# Altium project Vreg_Learning_Platform.PrjPcb (part 1 of 5)
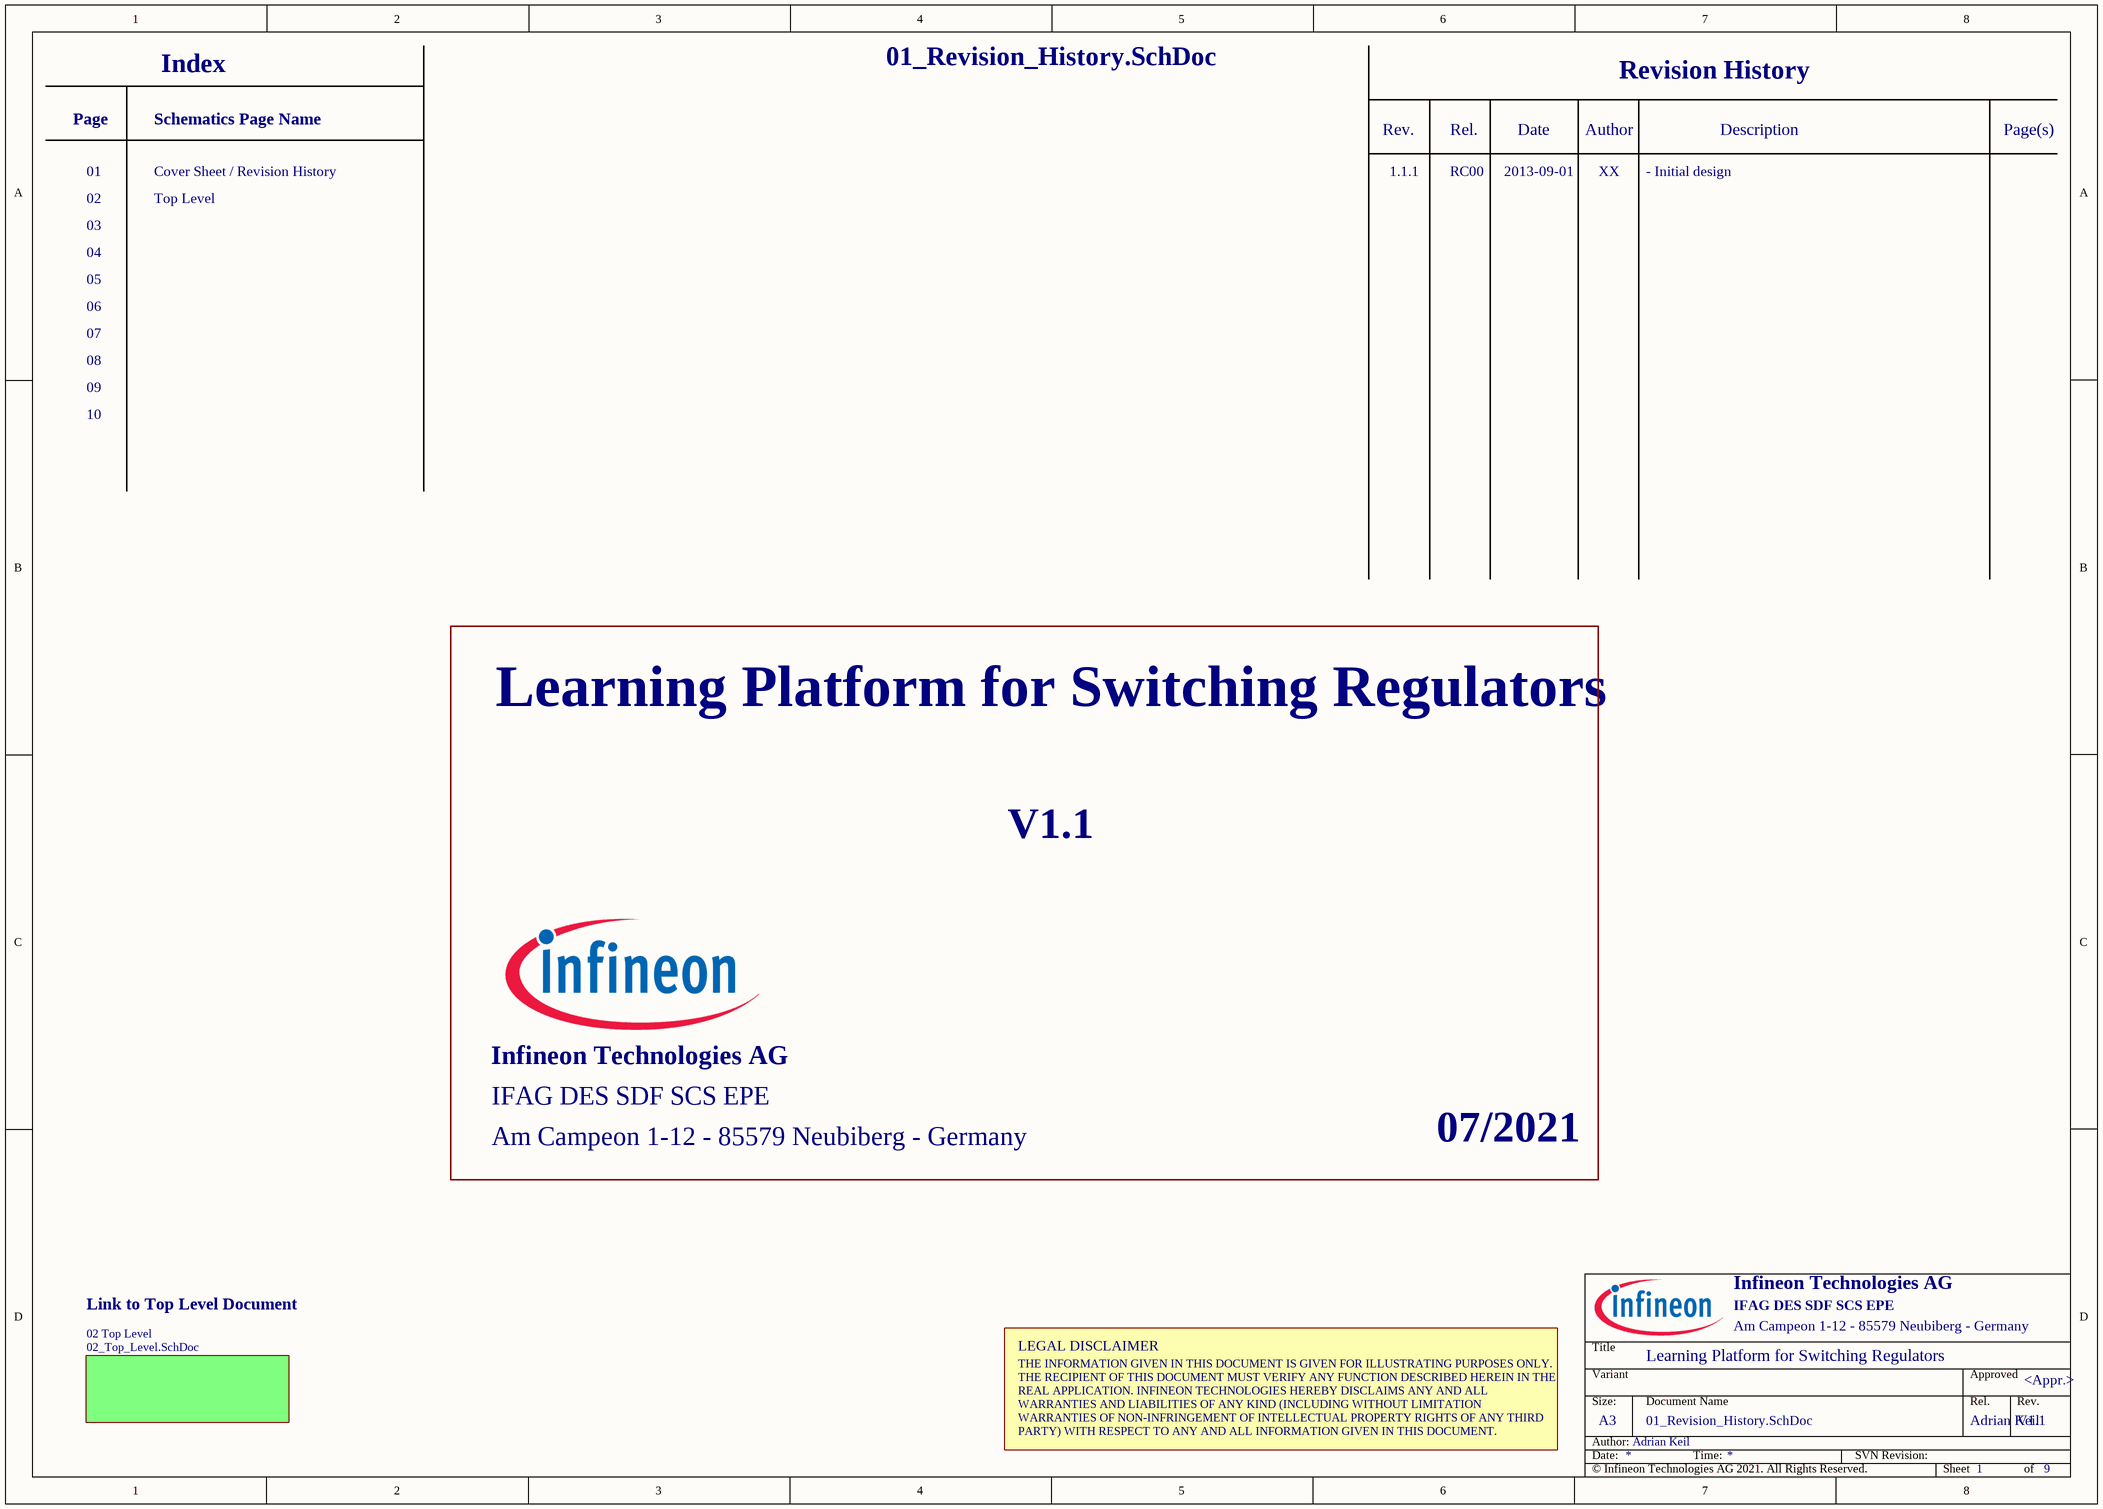
[diagram p0: 01_Revision_History.SchDoc]
PRJ_Year: 07/2021; PRJ_Title: Learning Platform for Switching Regulators; PRJ_SCH_Revision: V1.1; PRJ_SCH_Author: Adrian Keil; PRJ_Revision: V1.1; PRJ_Responsible: Adrian Keil; PRJ_PCB_Revision: V1.1; PRJ_PCB_Release: RC01; PRJ_PCBDesigner: Adrian Keil; PRJ_Organization: Infineon Technologies AG; PRJ_Engineer: Adrian Keil; PRJ_Copyright: © Infineon Technologies AG 2021. All Rights Reserved.; PRJ_Address2: Am Campeon 1-12 - 85579 Neubiberg - Germany; PRJ_Address1: IFAG DES SDF SCS EPE
7 sheets, 308 parts. Net scope: flat (ports and power ports of the same name join across sheets).
Board file: Mainboard.PcbDoc
Sheets:
  01_Revision_History.SchDoc
    02 Top Level = 02_Top_Level.SchDoc
      U_Input = Input.SchDoc
      U_PowerStage = PowerStage.SchDoc
      U_PowerSupply = PowerSupply.SchDoc
      U_Safety = Safety.SchDoc
      U_Output = Output.SchDoc

## Sheet 01_Revision_History.SchDoc: <Project Name>
size A3; ApprovedBy: <Appr.>; Author: <Author>; CompanyName: Infineon Technologies AG; Engineer: <Rel.>; Organization: Infineon Technologies AG; Address1: COM AC SDC SD3; Address2: Am Campeon 1-12  -  85579 Neubiberg  -  Germany; Address3: 85579 Neubiberg; Address4: Germany; DocumentNumber: 1; Revision: <Rev.>; SheetNumber: 1; SheetTotal: 9; Release: RC00; PageSetup: Record=PageOptions|CenterHorizontal=True|CenterVertical=True|PrintScale=1.01|XCorrection=1.00|YCorrection=1.00|PrintKind=0|BorderSize=5000000|LeftOffset=0|BottomOffset=0|Orientation=2|PaperLength=1000|PaperWidth=1000|Scale=100|PaperSource=7|PrintQuality=-4|MediaType=1|DitherType=10|PaperKind=A3|PrintScaleMode=1; Doc_ConfidentialStatus: <Doc_ConfidentialStatus>; Doc_Preliminary: <Doc_Preliminary>

### Sub-sheets
02 Top Level = 02_Top_Level.SchDoc: no entries

### Notes on the sheet
- Index
- Revision History
- Page
- 01
- Cover Sheet / Revision History
- Schematics Page Name
- Rev.
- 1.1.1
- Rel.
- RC00
- 2013-09-01
- Date
- Author
- XX
- - Initial design
- Description
- Page(s)
- 03
- 02
- Top Level
- 04
- 05
- 06
- 07
- 08
- 09
- 10
- Link to Top Level Document
- LEGAL DISCLAIMER
- THE INFORMATION GIVEN IN THIS DOCUMENT IS GIVEN FOR ILLUSTRATING PURPOSES ONLY.
  THE RECIPIENT OF THIS DOCUMENT MUST VERIFY ANY FUNCTION DESCRIBED HEREIN IN THE
  REAL APPLICATION. INFINEON TECHNOLOGIES HEREBY DISCLAIMS ANY AND ALL
  WARRANTIES AND LIABILITIES OF ANY KIND (INCLUDING WITHOUT LIMITATION
  WARRANTIES OF NON-INFRINGEMENT OF INTELLECTUAL PROPERTY RIGHTS OF ANY THIRD
  PARTY) WITH RESPECT TO ANY AND ALL INFORMATION GIVEN IN THIS DOCUMENT.
- Title
- Variant
- Approved
- Date:
- Author:
- Size:
- A3
- Document Name
- Time:
- SVN Revision:
- Sheet
- of

## Sheet 02_Top_Level.SchDoc: <Project Name>
size A3; ApprovedBy: <Appr.>; Author: <Author>; CompanyName: Infineon Technologies AG; Engineer: <Rel.>; Organization: Infineon Technologies AG; Address1: COM AC SDC SD3; Address2: Am Campeon 1-12  -  85579 Neubiberg  -  Germany; Address3: 85579 Neubiberg; Address4: Germany; DocumentNumber: 2; Revision: <Rev.>; SheetNumber: 2; SheetTotal: 9; Release: RC00; PageSetup: Record=PageOptions|CenterHorizontal=True|CenterVertical=True|PrintScale=1.01|XCorrection=1.00|YCorrection=1.00|PrintKind=0|BorderSize=5000000|LeftOffset=0|BottomOffset=0|Orientation=2|PaperLength=1000|PaperWidth=1000|Scale=100|PaperSource=7|PrintQuality=-4|MediaType=1|DitherType=10|PaperKind=A3|PrintScaleMode=1; Doc_ConfidentialStatus: <Doc_ConfidentialStatus>; Doc_Preliminary: <Doc_Preliminary>
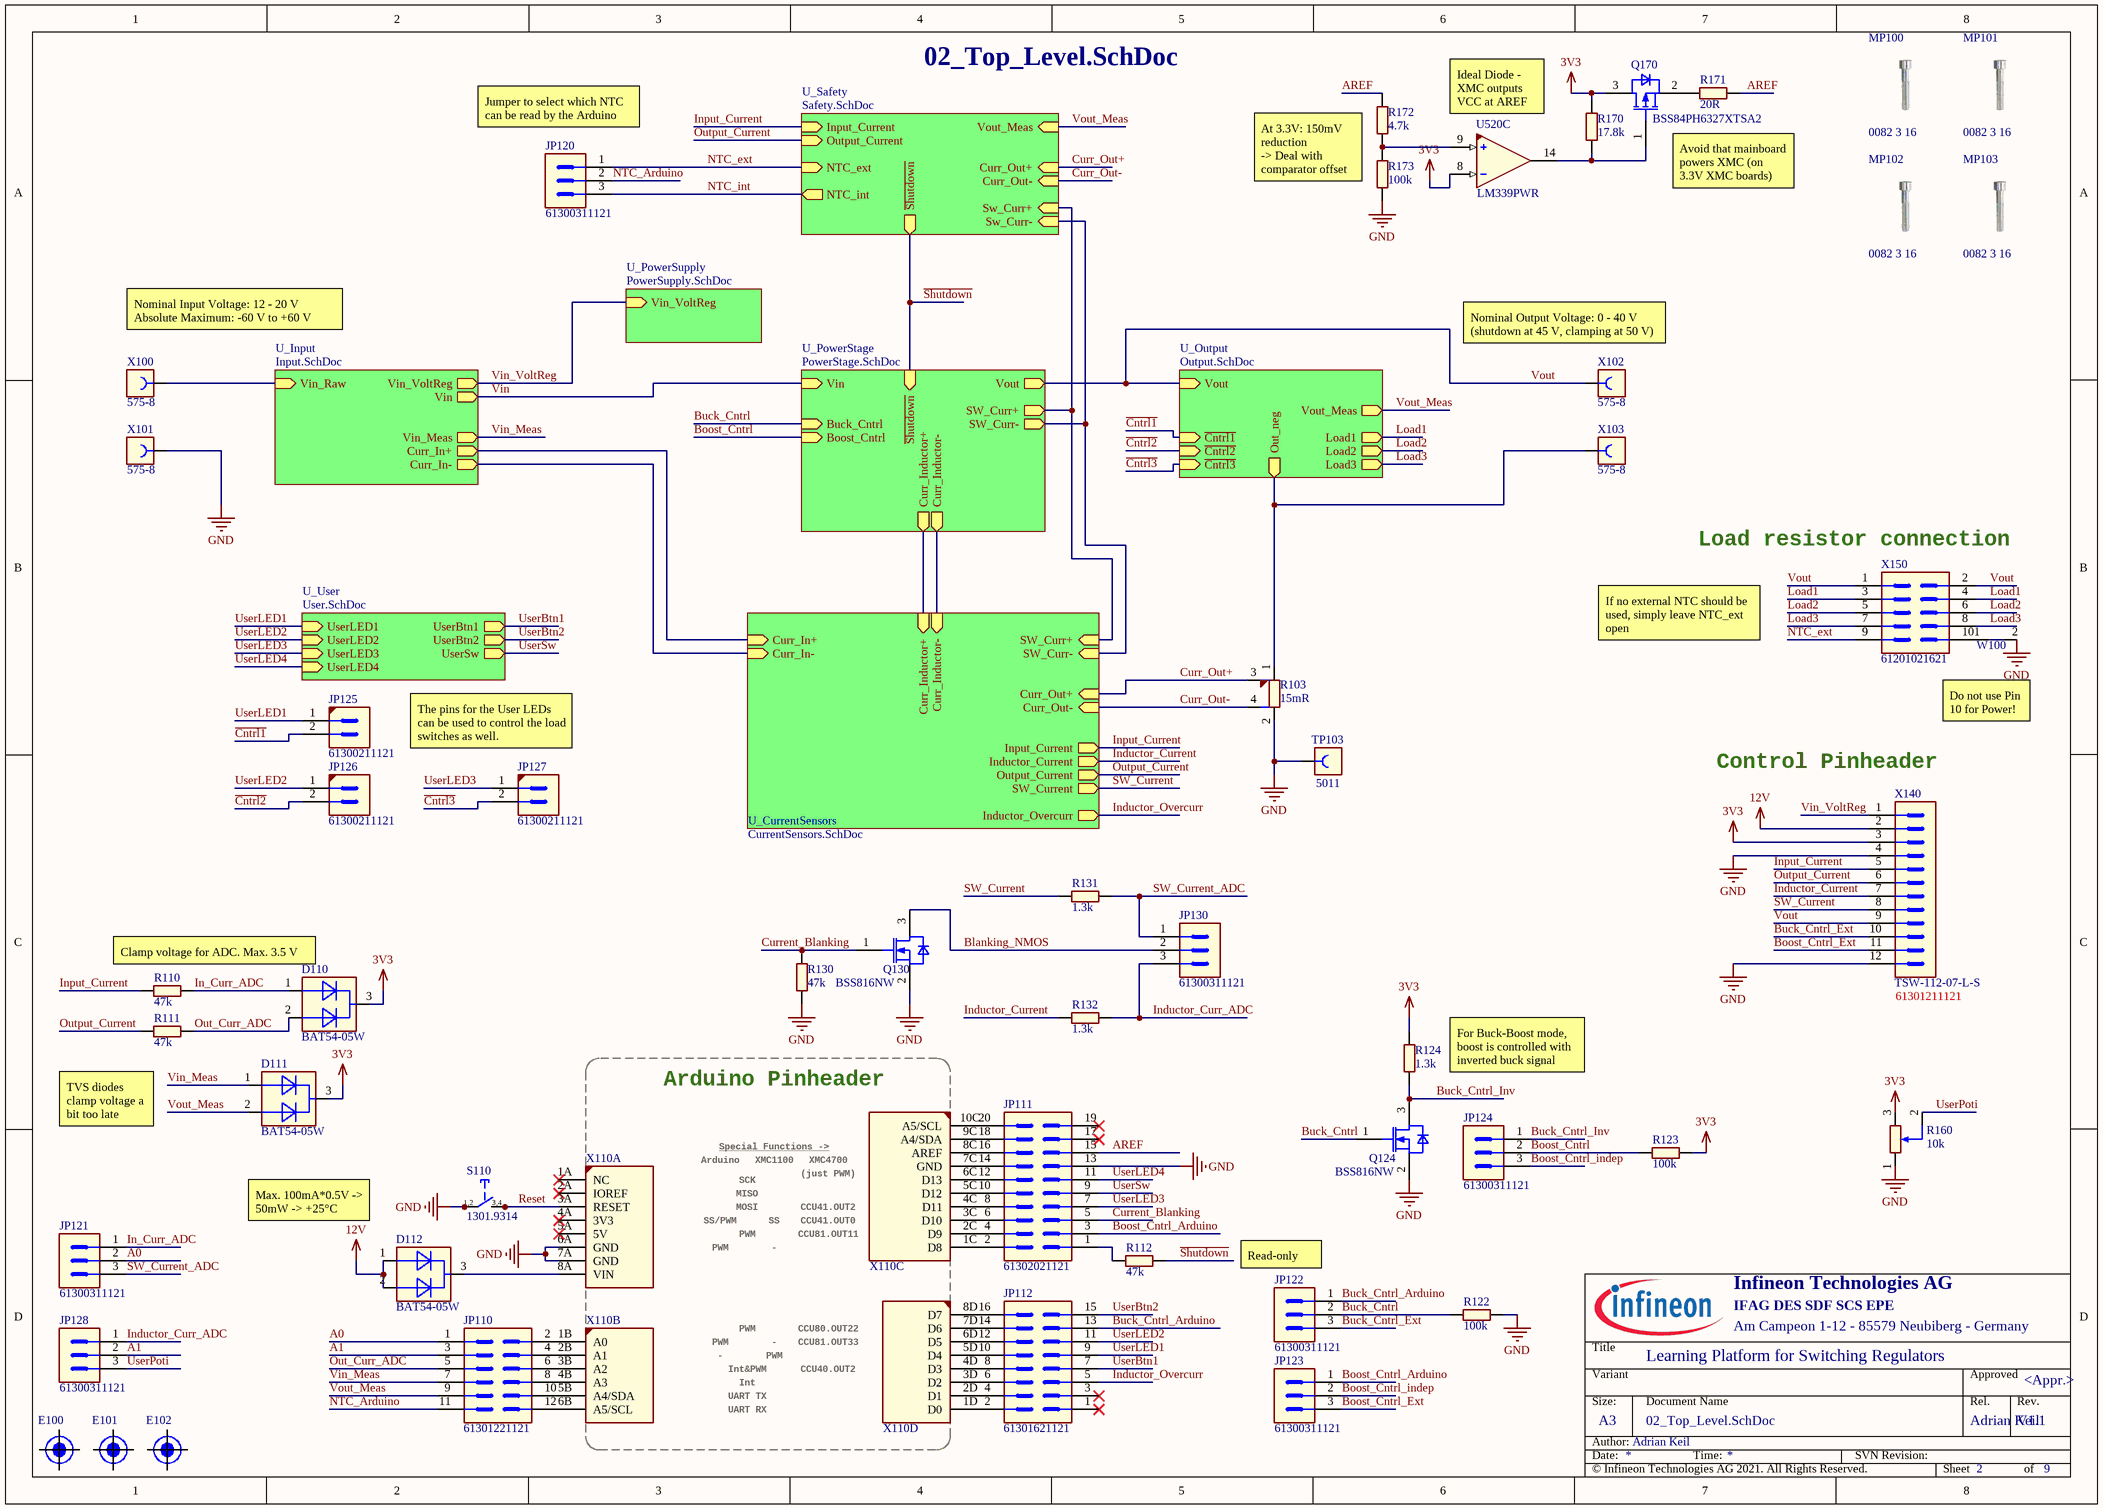
[diagram p1: 02_Top_Level.SchDoc]

### Parts
D110  BAT54-05W  [SOT65P210X100-3N-1-V]
D111  BAT54-05W  [SOT65P210X100-3N-1-V]
D112  BAT54-05W  [SOT65P210X100-3N-1-V]
E100  (no value)  [fiducial]  (no BOM)
E101  (no value)  [fiducial]  (no BOM)
E102  (no value)  [fiducial]  (no BOM)
JP110  61301221121  [CON-M-THT-61301221121]
JP111  61302021121  [CON-M-THT-61302021121]
JP112  61301621121  [CON-M-THT-61301621121]
JP120  61300311121  [CON-M-THT-61300311121]
JP121  61300311121  [CON-M-THT-61300311121]
JP122  61300311121  [CON-M-THT-61300311121]
JP123  61300311121  [CON-M-THT-61300311121]
JP124  61300311121  [CON-M-THT-61300311121]
JP125  61300211121  [CON-M-THT-61300211121]
JP126  61300211121  [CON-M-THT-61300211121]
JP127  61300211121  [CON-M-THT-61300211121]
JP128  61300311121  [CON-M-THT-61300311121]
JP130  61300311121  [CON-M-THT-61300311121]
MP100  0082 3 16  [SCREW_0082 3 16_NPTH]
MP101  0082 3 16  [SCREW_0082 3 16_NPTH]
MP102  0082 3 16  [SCREW_0082 3 16_NPTH]
MP103  0082 3 16  [SCREW_0082 3 16_NPTH]
Q124  BSS816NW  [SOT65P210X100-3N-1-V]
Q130  BSS816NW  [SOT65P210X100-3N-1-V]
Q170  BSS84PH6327XTSA2  [SOT95P240X110-3N-1]
R103  15mR  [RES-SMD-L4T12]
R110  47k  [RESC1609X50N]
R111  47k  [RESC1609X50N]
R112  47k  [RESC1609X50N]
R122  100k  [RESC1609X50N]
R123  100k  [RESC1609X50N]
R124  1.3k  [RESC1609X50N]
R130  47k  [RESC1609X50N]
R131  1.3k  [RESC1609X50N]
R132  1.3k  [RESC1609X50N]
R160  10k  [POT-SMD-3361P]
R170  17.8k  [RESC1609X50N]
R171  20R  [RESC1609X50N]
R172  4.7k  [RESC1609X50N]
R173  100k  [RESC1609X50N]
S110  1301.9314  [SW-SMD-1301.9314]
TP103  5011  [CON-THT-TP-5011]
U520  LM339PWR  [SOP65P640X120-14N-1]  (part C of 5)
W100  Net_Tie_2  [Net_Tie_Small_2P]  (value not drawn)  (net tie, no BOM)
X100  575-8  [CON-F-TH-575-6]
X101  575-8  [CON-F-TH-575-6]
X102  575-8  [CON-F-TH-575-6]
X103  575-8  [CON-F-TH-575-6]
X110  Arduino-Uno  [Arduino-Uno]  (value not drawn)  (parts A,B,C,D of 4)
X140  TSW-112-07-L-S  [HDRV12W64P254_1X12_3048X254X898B]
X150  61201021621  [CON-M-THT-61201021621]

### Sub-sheets
U_CurrentSensors = CurrentSensors.SchDoc (file not in this document): Inductor_Current (out), Output_Current (out), Input_Current (out), Curr_In+ (in), Curr_In- (in), Curr_Inductor+ (in), Curr_Inductor- (in), Curr_Out+ (in), Curr_Out- (in), SW_Curr- (in), SW_Curr+ (in), SW_Current (out), Inductor_Overcurr (out)
U_Input = Input.SchDoc: Vin_Raw (in), Vin (out), Vin_Meas (out), Vin_VoltReg (out), Curr_In+ (out), Curr_In- (out)
U_Output = Output.SchDoc: Vout (in), Load1 (out), Load2 (out), Load3 (out), Vout_Meas (out), ~{Cntrl1} (in), ~{Cntrl2} (in), ~{Cntrl3} (in), Out_neg (out)
U_PowerStage = PowerStage.SchDoc: Vin (in), ~{Shutdown} (in), Buck_Cntrl (in), Boost_Cntrl (in), Vout (out), Curr_Inductor+ (out), Curr_Inductor- (out), SW_Curr+ (out), SW_Curr- (out)
U_PowerSupply = PowerSupply.SchDoc: Vin_VoltReg (in)
U_Safety = Safety.SchDoc: ~{Shutdown} (out), Vout_Meas (in), NTC_ext (in), NTC_int (out), Sw_Curr+ (in), Output_Current (in), Input_Current (in), Sw_Curr- (in), Curr_Out- (in), Curr_Out+ (in)
U_User = User.SchDoc (file not in this document): UserLED1 (in), UserLED2 (in), UserLED3 (in), UserLED4 (in), UserBtn1 (out), UserBtn2 (out), UserSw (out)

### Nets
3V3: D110.3(CATHODE) D111.3(CATHODE) Q170.3(DRAIN) R123.1 R124.2 R160.3 R170.1 U520.8(3IN_N) X140.3
12V: D112.1(ANODE_1) D112.2(ANODE_2) X140.2
GND: JP111.13 Q124.2(SOURCE) Q130.2(SOURCE) R103.2(V2) R122.1 R130.1 R160.1 R173.1 S110.1 S110.2 TP103.1 W100.2 X101.1 X110.6A(GND) X110.7A(GND) X140.4 X140.12
~{Cntrl1}: JP125.2 ; sheet U_Output/~{Cntrl1}
~{Cntrl2}: JP126.2 ; sheet U_Output/~{Cntrl2}
~{Cntrl3}: JP127.2 ; sheet U_Output/~{Cntrl3}
~{Shutdown}: R112.1 ; sheet U_PowerStage/~{Shutdown}, sheet U_Safety/~{Shutdown}
A0: JP110.1 JP121.2
A1: JP110.3 JP128.2
AREF: JP111.15 R171.1 R172.1
Blanking_NMOS: JP130.2 Q130.3(DRAIN)
Boost_Cntrl: JP124.2 R123.2 ; sheet U_PowerStage/Boost_Cntrl
Boost_Cntrl_Arduino: JP111.3 JP123.1
Boost_Cntrl_Ext: JP123.3 X140.11
Boost_Cntrl_indep: JP123.2 JP124.3
Buck_Cntrl: JP122.2 Q124.1(GATE) R122.2 ; sheet U_PowerStage/Buck_Cntrl
Buck_Cntrl_Arduino: JP112.13 JP122.1
Buck_Cntrl_Ext: JP122.3 X140.10
Buck_Cntrl_Inv: JP124.1 Q124.3(DRAIN) R124.1
Curr_Out+: R103.3(I1) ; sheet U_Safety/Curr_Out+, sheet U_CurrentSensors/Curr_Out+
Curr_Out-: R103.4(I2) ; sheet U_Safety/Curr_Out-, sheet U_CurrentSensors/Curr_Out-
Current_Blanking: JP111.5 Q130.1(GATE) R130.2
In_Curr_ADC: D110.1(ANODE_1) JP121.1 R110.1
Inductor_Curr_ADC: JP128.1 JP130.3 R132.1
Inductor_Current: R132.2 X140.7 ; sheet U_CurrentSensors/Inductor_Current
Inductor_Overcurr: JP112.5 ; sheet U_CurrentSensors/Inductor_Overcurr
Input_Current: R110.2 X140.5 ; sheet U_Safety/Input_Current, sheet U_CurrentSensors/Input_Current
Load1: X150.3 X150.4 ; sheet U_Output/Load1
Load2: X150.5 X150.6 ; sheet U_Output/Load2
Load3: X150.7 X150.8 ; sheet U_Output/Load3
NTC_Arduino: JP110.11 JP120.2
NTC_ext: JP120.1 X150.9 ; sheet U_Safety/NTC_ext
NTC_int: JP120.3 ; sheet U_Safety/NTC_int
Out_Curr_ADC: D110.2(ANODE_2) JP110.5 R111.1
Output_Current: R111.2 X140.6 ; sheet U_Safety/Output_Current, sheet U_CurrentSensors/Output_Current
Reset: S110.3 S110.4 X110.3A(RESET)
SW_Current: R131.2 X140.8 ; sheet U_CurrentSensors/SW_Current
SW_Current_ADC: JP121.3 JP130.1 R131.1
UserBtn1: JP112.7 ; sheet U_User/UserBtn1
UserBtn2: JP112.15 ; sheet U_User/UserBtn2
UserLED1: JP112.9 JP125.1 ; sheet U_User/UserLED1
UserLED2: JP112.11 JP126.1 ; sheet U_User/UserLED2
UserLED3: JP111.7 JP127.1 ; sheet U_User/UserLED3
UserLED4: JP111.11 ; sheet U_User/UserLED4
UserPoti: JP128.3 R160.2
UserSw: JP111.9 ; sheet U_User/UserSw
Vin: sheet U_Input/Vin, sheet U_PowerStage/Vin
Vin_Meas: D111.1(ANODE_1) JP110.7 ; sheet U_Input/Vin_Meas
Vin_VoltReg: X140.1 ; sheet U_Input/Vin_VoltReg, sheet U_PowerSupply/Vin_VoltReg
Vout: X102.1 X140.9 X150.1 X150.2 ; sheet U_PowerStage/Vout, sheet U_Output/Vout
Vout_Meas: D111.2(ANODE_2) JP110.9 ; sheet U_Safety/Vout_Meas, sheet U_Output/Vout_Meas
NetD112_3: D112.3(CATHODE) X110.8A(VIN)
NetJP110_2: JP110.2 X110.1B(A0)
NetJP110_4: JP110.4 X110.2B(A1)
NetJP110_6: JP110.6 X110.3B(A2)
NetJP110_8: JP110.8 X110.4B(A3)
NetJP110_10: JP110.10 X110.5B(A4/SDA)
NetJP110_12: JP110.12 X110.6B(A5/SCL)
NetJP111_1: JP111.1 R112.2
NetJP111_2: JP111.2 X110.1C(D8)
NetJP111_4: JP111.4 X110.2C(D9)
NetJP111_6: JP111.6 X110.3C(D10)
NetJP111_8: JP111.8 X110.4C(D11)
NetJP111_10: JP111.10 X110.5C(D12)
NetJP111_12: JP111.12 X110.6C(D13)
NetJP111_14: JP111.14 X110.7C(GND)
NetJP111_16: JP111.16 X110.8C(AREF)
NetJP111_18: JP111.18 X110.9C(A4/SDA)
NetJP111_20: JP111.20 X110.10C(A5/SCL)
NetJP112_2: JP112.2 X110.1D(D0)
NetJP112_4: JP112.4 X110.2D(D1)
NetJP112_6: JP112.6 X110.3D(D2)
NetJP112_8: JP112.8 X110.4D(D3)
NetJP112_10: JP112.10 X110.5D(D4)
NetJP112_12: JP112.12 X110.6D(D5)
NetJP112_14: JP112.14 X110.7D(D6)
NetJP112_16: JP112.16 X110.8D(D7)
NetQ170_1: Q170.1(GATE) R170.2 U520.14(3OUT)
NetQ170_2: Q170.2(SOURCE) R171.2
NetR103_1: R103.1(V1) X103.1 ; sheet U_Output/Out_neg
NetR172_2: R172.2 R173.2 U520.9(3IN_P)
NetW100_1: W100.1 X150.10
NetX100_1: X100.1 ; sheet U_Input/Vin_Raw
(unnamed): sheet U_Input/Curr_In+, sheet U_CurrentSensors/Curr_In+
(unnamed): sheet U_Input/Curr_In-, sheet U_CurrentSensors/Curr_In-
(unnamed): sheet U_PowerStage/Curr_Inductor+, sheet U_CurrentSensors/Curr_Inductor+
(unnamed): sheet U_PowerStage/Curr_Inductor-, sheet U_CurrentSensors/Curr_Inductor-
(unnamed): sheet U_PowerStage/SW_Curr+, sheet U_Safety/Sw_Curr+, sheet U_CurrentSensors/SW_Curr+
(unnamed): sheet U_PowerStage/SW_Curr-, sheet U_Safety/Sw_Curr-, sheet U_CurrentSensors/SW_Curr-

Not connected (* = marked no-connect by the designer): E100 1; E101 1; E102 1; JP111 17* 19*; JP112 1* 3*; X110 1A(NC)* 2A(IOREF)* 4A(3V3)* 5A(5V)*

### Notes on the sheet
- Ideal Diode -
  XMC outputs VCC at AREF
- (near JP120) Jumper to select which NTC  can be read by the Arduino
- At 3.3V: 150mV reduction
  -> Deal with comparator offset
  AREF: 3.45V max.
- (near Q170) Avoid that mainboard powers XMC (on 3.3V XMC boards)
- Nominal Input Voltage: 12 - 20 V
  Absolute Maximum: -60 V to +60 V
- (near X102) Nominal Output Voltage: 0 - 40 V (shutdown at 45 V, clamping at 50 V)
- (near X150) Load resistor connection
- If no external NTC should be used, simply leave NTC_ext open
- Do not use Pin 10 for Power!
- (near JP127) The pins for the User LEDs can be used to control the load switches as well.
- (near X140) Control Pinheader
- Clamp voltage for ADC. Max. 3.5 V
- (near X140) 61301211121
- (near R111) TVS diodes clamp voltage a bit too late
- Arduino Pinheader
- (near R124) For Buck-Boost mode, boost is controlled with inverted buck signal
- Arduino
- SCK
- MISO
- Special Functions ->
- XMC1100
- XMC4700
- (just PWM)
- Max. 100mA*0.5V -> 50mW -> +25°C
- SS/PWM
- PWM
- MOSI
- -
- SS
- CCU41.OUT0
- CCU41.OUT2
- CCU81.OUT11
- (near JP122) Read-only
- CCU80.OUT22
- UART TX
- Int
- Int&PWM
- CCU81.OUT33
- CCU40.OUT2
- UART RX
- Title
- Variant
- Approved
- Date:
- Author:
- Size:
- A3
- Document Name
- Time:
- SVN Revision:
- Rel.
- Rev.
- Sheet
- of
- (in symbol 380147) 1,2; 3,4

### Library data of the parts
D110-D112 = 592214: Silicon Schottky Diode, VR 30V; Manufacturer: Infineon Technologies; Symbol type: Dual Diode Symbol 3 Pins, 1 Anode, 2 Anode, 3 Cathode; Article Number: 592214; Version Number: V01; Combined Parameters: Vf:800mV;If:200mA;Ur:30V;Ir:2uA;Pmax:230mW; QuickPick: Schottky Diode / PG-SOT323-3-1; Style: Single; Automotive Qualified: AEC Q101; ComponentStatus: Released; PLMStatus: Active; Second Source allowed: Yes; Voltage DC (max): na; Part Type: Diode; Manufacturer Order Number: BAT54-05W; Value: BAT54-05W; Type: Schottky Diode; Application: Protection; Temperature min: 0; Temperature max: 150; Temperature Range: Military; ROHS Compliant: Y; PackageReference: PG-SOT323-3-1; ComponentLink1Description: Vendor WebSite; ComponentLink1URL: https://www.infineon.com/; ComponentLink2Description: Datasheet; ComponentLink2URL: http://webnetprod.muc.infineon.com/PCBPortal_Prod/WorkFlows/AltiumComponent/StandardDocumentation?Versionid=592215; Supplier 1: Farnell; Supplier Part Number 1: 2787840; Supplier 2: DigiKey; Supplier Part Number 2: BAT5405WH6327XTSA1TR-ND; Supplier 3: Mouser; Package Description: SOT,0.65mm pitch;3 pin,1.25mm W X 2.00mm L X 1.00mm H body
E100-E102 = 416637: Fiducial Mark; Legacy PartNumber: MEC10000008; Manufacturer: Infineon Technologies; Alternate View: No; Symbol Type: Fiducial Marker For PCB; Article Number: 416637; Version Number: V01; Legacy DeviceID: MEC_Fiducial_Mark; Combined Parameters: - - -x- -; ComponentStatus: Released; PLMStatus: Active; Second Source allowed: Yes; Voltage DC (max): na; Multible Parts: No; Part Type: Mechanical; Temperature min: 0; Temperature max: 0; Temperature Range: Military; ComponentLink1Description: Vendor WebSite; ComponentLink1URL: https://www.infineon.com/; ComponentLink2Description: Datasheet; ComponentLink2URL: http://webnetprod.muc.infineon.com/PCBPortal_Prod/WorkFlows/AltiumComponent/StandardDocumentation?Versionid=416638; Supplier 1: Farnell; Supplier 2: DigiKey; Supplier 3: Mouser
JP110 = 651705: WR-PHD Dual Pin Header, 2.54mm Pitch, Double row, 12 Pins; Manufacturer: Wurth Elektronik; Article Number: 651705; Version Number: V00; Legacy DeviceID: WE_61301221121; Combined Parameters: Board-to-Board Header (male);2x6;Mounting:THT;Orient:0° (vertical);Shielded:No; QuickPick: 0° (vertical) / Board-to-Board; Style: Strip; Automotive Qualified: No; ComponentStatus: Released; PLMStatus: Active; Second Source allowed: Yes; Voltage DC (max): na; Part Type: Connector; Manufacturer Order Number: 61301221121; Value: 61301221121; Type: Board-to-Board; Temperature min: -40; Temperature max: 105; Temperature Range: Industrial; ROHS Compliant: Y; PackageReference: 2.54mm THT; ComponentLink1Description: Vendor WebSite; ComponentLink1URL: http://www.we-online.com; ComponentLink2Description: Datasheet; ComponentLink2URL: http://webnetprod.muc.infineon.com/PCBPortal_Prod/WorkFlows/AltiumComponent/StandardDocumentation?Versionid=651706; Supplier 1: Farnell; Supplier Part Number 1: 2356134; Supplier 2: DigiKey; Supplier Part Number 2: 732-5297-ND; Supplier 3: Mouser; Supplier Part Number 3: 710-61301221121; Package Description: Connector, THT, 2.54 mm pitch, 12 pin, 5.08 mm L X 15.24 mm W X 8.89 mm H body
JP111 = 651707: WR-PHD Dual Pin Header, 2.54mm Pitch, Double row, 20 Pins; Manufacturer: Wurth Elektronik; Article Number: 651707; Version Number: V00; Legacy DeviceID: WE_61302021121; Combined Parameters: Board-to-Board Header (male);2x10;Mounting:THT;Orient:0° (vertical);Shielded:No; QuickPick: 0° (vertical) / Board-to-Board; Style: Strip; Automotive Qualified: No; ComponentStatus: Released; PLMStatus: Active; Second Source allowed: Yes; Voltage DC (max): na; Symbol Type: Header 10x2; Part Type: Connector; Manufacturer Order Number: 61302021121; Value: 61302021121; Type: Board-to-Board; Temperature min: -40; Temperature max: 105; Temperature Range: Industrial; ROHS Compliant: Y; PackageReference: 2.54mm THT; ComponentLink1Description: Vendor WebSite; ComponentLink1URL: http://www.we-online.com; ComponentLink2Description: Datasheet; ComponentLink2URL: http://webnetprod.muc.infineon.com/PCBPortal_Prod/WorkFlows/AltiumComponent/StandardDocumentation?Versionid=651708; Supplier 1: Farnell; Supplier Part Number 1: 2356138; Supplier 2: DigiKey; Supplier Part Number 2: 732-5301-ND; Supplier 3: Mouser; Supplier Part Number 3: 710-61302021121; Package Description: Connector, THT, 2.54 mm Pitch, 20 pin, 5.08 mm L X 25.40 mm W X 8.89 mm H body
JP112 = 638527: Connector Header Through Hole 16 position 0.100 (2.54mm); Manufacturer: Wurth Elektronik; Article Number: 638527; Version Number: V01; Legacy DeviceID: WE_61301621121; Combined Parameters: Board-to-Board Header (male);8x2;Mounting:THT;Orient:0° (vertical);Shielded:No; QuickPick: 0° (vertical) / Board-to-Board; Style: Strip; Automotive Qualified: No; ComponentStatus: Released; PLMStatus: Active; Second Source allowed: Yes; Voltage DC (max): na; Part Type: Connector; Manufacturer Order Number: 61301621121; Value: 61301621121; Type: Board-to-Board; Temperature min: -40; Temperature max: 105; Temperature Range: Industrial; ROHS Compliant: Y; PackageReference: THT; ComponentLink1Description: Vendor WebSite; ComponentLink1URL: http://www.we-online.com; ComponentLink2Description: Datasheet; ComponentLink2URL: http://webnetprod.muc.infineon.com/PCBPortal_Prod/WorkFlows/AltiumComponent/StandardDocumentation?Versionid=638528; Supplier 1: Farnell; Supplier Part Number 1: 2356136; Supplier 2: DigiKey; Supplier Part Number 2: 732-5299-ND; Supplier 3: Mouser; Supplier Part Number 3: 710-61301621121; Package Description: Connector, THT, 2.54 mm pitch, 16 pin, 5.08 mm L X 20.32 mm W X 8.89 mm H body
JP120-JP124 JP128 JP130 = 633993: WR-PHD Pin Header; Manufacturer: Wurth Elektronik; Article Number: 633993; Version Number: V01; Legacy DeviceID: WE_61300311121; Combined Parameters: Board-to-Cable Header (male);3x1;Mounting:THT;Orient:0° (vertical);Shielded:No; QuickPick: 0° (vertical) / Board-to-Cable; Style: Strip; Automotive Qualified: No; ComponentStatus: Released; PLMStatus: Active; Second Source allowed: Yes; Voltage DC (max): na; Part Type: Connector; Manufacturer Order Number: 61300311121; Value: 61300311121; Type: Board-to-Cable; Temperature min: -40; Temperature max: 105; Temperature Range: Industrial; ROHS Compliant: Y; PackageReference: THT; ComponentLink1Description: Vendor WebSite; ComponentLink1URL: http://www.we-online.com; ComponentLink2Description: Datasheet; ComponentLink2URL: http://webnetprod.muc.infineon.com/PCBPortal_Prod/WorkFlows/AltiumComponent/StandardDocumentation?Versionid=633994; Supplier 1: Farnell; Supplier Part Number 1: 2356154; Supplier 2: DigiKey; Supplier Part Number 2: 732-5316-ND; Supplier 3: Mouser; Supplier Part Number 3: 710-61300311121; Package Description: Connector, THT; 2.54mm pitch, 7.62 mm L X 2.54 mm X 8.89 mm H body
JP125-JP127 = 386760: Header, 2.54mm Pitch, 2 pin, Vertical, Single Row; Legacy PartNumber: CON01500943; Manufacturer: Wurth Elektronik; Alternat View: Yes; Article Number: 386760; Version Number: V01; Legacy DeviceID: WE_61300211121; Combined Parameters: Board-to-Board Header (male);2x1;Mounting:THT;Orient:0° (vertical);Shielded:No; QuickPick: 0° (vertical) / Board-to-Board; Style: Strip; Automotive Qualified: No; ComponentStatus: Released; PLMStatus: Active; Voltage DC (max): na; Part Type: Connector; Manufacturer Order Number: 61300211121; Value: 61300211121; Type: Board-to-Board; Temperature min: -40; Temperature max: 105; Temperature Range: Industrial; ROHS Compliant: Y; ComponentLink1Description: Vendor WebSite; ComponentLink1URL: http://www.we-online.com; ComponentLink2Description: Datasheet; ComponentLink2URL: http://webnetprod.muc.infineon.com/PCBPortal_Prod/WorkFlows/AltiumComponent/StandardDocumentation?Versionid=386761; Supplier 1: Farnell; Supplier Part Number 1: 2356153; Supplier 2: DigiKey; Supplier Part Number 2: 732-5315-ND; Supplier 3: Mouser; Supplier Part Number 3: 710-61300211121; Second Source allowed: Yes; Package Description: Header, Vertical, 2.54mm Pitch; 2 Pins, Single row, 5.08mm L X 2.54mm W X 8.89mm H body
MP100-MP103 = 455343: Cheese Head Screw With Hexagon Socket, DIN 912 (ISO 4762), M3, 16mm length; Legacy PartNumber: MEC10000167; Manufacturer: Wurth Elektronik; Alternate View: No; Symbol Type: Cheese-Head Screw, M2.5X5-DIN 912; Article Number: 455343; Version Number: V01; Legacy DeviceID: MEC_0082 3 16; Combined Parameters: Steel Hexagonal 19x5.68 Screw; Style: Hexagonal; ComponentStatus: Released; PLMStatus: Active; Second Source allowed: Yes; Voltage DC (max): na; Multiple Parts: No; Part Type: Mechanical; Manufacturer Order Number: 0082 3 16; Value: 0082 3 16; QuickPick: Screw; Type: Screw; Temperature min: 0; Temperature max: 0; Temperature Range: Military; ROHS Compliant: N; Automotive Qualified: No; PackageReference: THT; ComponentLink1Description: Vendor WebSite; ComponentLink1URL: http://www.we-online.com; ComponentLink2Description: Datasheet; ComponentLink2URL: http://webnetprod.muc.infineon.com/PCBPortal_Prod/WorkFlows/AltiumComponent/StandardDocumentation?Versionid=455344; Supplier 1: Farnell; Supplier 2: DigiKey; Supplier 3: Mouser; Package Description: M3 Cheese Head Screw X 5.68mm Head
Q124 Q130 = 644598: OptiMOS 2 Small-Signal-Transistor; Manufacturer: Infineon Technologies; Symbol Type: Insulated-Gate Field-Effect Transistor (IGFET), N-Channel, Depletion,  Body Diode, Pin 1 Gate, 2 Source, 3 Drain, 3 Pins; Article Number: 644598; Version Number: V01; Legacy DeviceID: IFX_BSS816NW; Combined Parameters: N-Channel Enhancement;Uds:20V;Id:1.4A;Rds:240R;P:500mW; QuickPick: N-Channel Enhancement / 500mW / 1.4A / 20V / PG-SOT323-3-2; Type: N-Channel Enhancement; Style: Single; Automotive Qualified: AEC Q101; ComponentStatus: Released; PLMStatus: Active; Second Source allowed: Yes; Voltage DC (max): na; Part Type: Transistor FET; Manufacturer Order Number: BSS816NW; Value: BSS816NW; Application: Small Signal; Temperature min: -55; Temperature max: 150; Temperature Range: Military; ROHS Compliant: Y; PackageReference: PG-SOT323-3-2; ComponentLink1Description: Vendor WebSite; ComponentLink1URL: https://www.infineon.com/; ComponentLink2Description: Datasheet; ComponentLink2URL: http://webnetprod.muc.infineon.com/PCBPortal_Prod/WorkFlows/AltiumComponent/StandardDocumentation?Versionid=644599; Supplier 1: Farnell; Supplier Part Number 1: 2617470; Supplier 2: DigiKey; Supplier Part Number 2: BSS816NWH6327XTSA1CT-ND; Supplier 3: Mouser; Supplier Part Number 3: 726-SP000917562; Package Description: SOT,0.65mm pitch;3 pin,1.25mm W X 2.00mm L X 1.00mm H body
Q170 = 422992: SIPMOS P-Channel Enhancement Small-Signal-Transistor; Legacy PartNumber: IFX01400461; Manufacturer: Infineon Technologies; Symbol Type: Insulated-Gate Field-Effect Transistor (IGFET), P-Channel, Enhancement,  Body Diode, Pin 1 Gate, 2 Source, 3 Drain, 3 Pins; Article Number: 422992; Version Number: V01; Legacy DeviceID: IFX_BSS84PH6327XTSA2; Combined Parameters: P-Channel;Uds:-60V;Id:-170mA;Rds:12R;P:360mW; QuickPick: P-Channel / 360mW / -170mA / -60V / PG-SOT23; Style: Single; Automotive Qualified: AEC Q101; ComponentStatus: Released; PLMStatus: Active; Second Source allowed: Yes; Voltage DC (max): na; Part Type: Transistor FET; Manufacturer Order Number: BSS84PH6327XTSA2; Value: BSS84PH6327XTSA2; Type: P-Channel; Application: Power Supply; Temperature min: -55; Temperature max: 150; Temperature Range: Military; ROHS Compliant: Y; PackageReference: PG-SOT23; ComponentLink1Description: Vendor WebSite; ComponentLink1URL: https://www.infineon.com/; ComponentLink2Description: Datasheet; ComponentLink2URL: http://webnetprod.muc.infineon.com/PCBPortal_Prod/WorkFlows/AltiumComponent/StandardDocumentation?Versionid=422993; Supplier 1: Farnell; Supplier Part Number 1: 1056526; Supplier 2: DigiKey; Supplier Part Number 2: BSS84PH6327XTSA2TR-ND; Supplier 3: Mouser; Supplier Part Number 3: 726-BSS84PH6327XTSA2; Package Description: SOT23, 3-Leads, Body 2.90x2.40mm, Pitch 0.95mm, IPC Medium Density
R103 = 644055: RES / STD / 15mR / 500mW / 1% / 75ppm/K / -55°C to 155°C / 1206 (3216) / SMD / -; Multiple Parts: No; Manufacturer: Ohmite; Manufacturer Order Number: L4T12FR015FER; Symbol Type: Resistor; 4-Terminal (Shunt); Standard; 4 Pins; Alternate View: Yes; Article Number: 644055; Version Number: V01; Combined Parameters: TCR:75ppm/K;Tol.:-1%/+1%;Vdc:-;Idc:-;P:500mW; QuickPick: 15mR / 1% / 0.5 / 1206 (3216); Style: 4-Terminal (Shunt); ComponentStatus: Released; PLMStatus: Active; Part Type: Resistor; Value: 15mR; Tolerance Neg: 1%; Tolerance Pos: 1%; Type: Standard; Application: Precision; Technology: Thick Film; Temperature min: -55; Temperature max: 155; Temperature Range: Military; ROHS Compliant: Y; Automotive Qualified: No; PackageReference: 1206 (3216); ComponentLink1Description: Vendor WebSite; ComponentLink1URL: http://www.ohmite.com; ComponentLink2Description: Datasheet; ComponentLink2URL: http://webnetprod.muc.infineon.com/PCBPortal_Prod/WorkFlows/AltiumComponent/StandardDocumentation?Versionid=644056; Supplier 1: Farnell; Supplier Part Number 1: 3274221; Supplier 2: DigiKey; Supplier Part Number 2: 273-L4T12FR015FERCT-ND; Supplier 3: Mouser; Supplier Part Number 3: 284-L4T12FR015FER; Second Source allowed: Yes; Package Description: Resistor, SMD, 4 pin, 3.00 mm L X 1.60 mm W X 0.65 mm H body
R110-R112 R130 = 346552: RES / STD / 47k / 100mW / 1% / 100ppm/K / -55°C to 155°C / 0603 / SMD / -; Multiple Parts: No; Legacy PartNumber: RES01801333; Manufacturer: Vishay; Manufacturer Order Number: CRCW060347K0FK; Symbol Type: Resistor; Single; Standard; 2 Pins; Alternate View: Yes; Article Number: 346552; Version Number: V01; Combined Parameters: TCR:100ppm/K;Tol.:-1%/+1%;Vdc:75V;Idc:-;P:100mW; QuickPick: 47k / 1% / 0.1 / 0603; Style: Single; Automotive Qualified: AEC Q200; ComponentStatus: Released; PLMStatus: Active; Voltage DC (max): 75V; Legacy DeviceID: RES01801333; Part Type: Resistor; Value: 47k; Tolerance Neg: 1%; Tolerance Pos: 1%; Type: Standard; Technology: Thick Film; Temperature min: -55; Temperature max: 155; Temperature Range: Military; ROHS Compliant: Y; PackageReference: 0603; ComponentLink1Description: Vendor WebSite; ComponentLink1URL: http://www.vishay.com; ComponentLink2Description: Datasheet; ComponentLink2URL: http://webnetprod.muc.infineon.com/PCBPortal_Prod/WorkFlows/AltiumComponent/StandardDocumentation?Versionid=346553; Supplier 1: Farnell; Supplier 2: DigiKey; Supplier Part Number 2: 541-47.0KHCT-ND; Supplier 3: Mouser; Second Source allowed: Yes
R122 R123 R173 = 346742: RES / STD / 100k / 100mW / 1% / 100ppm/K / -55°C to 155°C / 0603 / SMD / -; Multiple Parts: No; Legacy PartNumber: RES01801371; Manufacturer: Vishay; Manufacturer Order Number: CRCW0603100KFK; Symbol Type: Resistor; Single; Standard; 2 Pins; Alternate View: Yes; Article Number: 346742; Version Number: V01; Combined Parameters: TCR:100ppm/K;Tol.:-1%/+1%;Vdc:75V;Idc:-;P:100mW; QuickPick: 100k / 1% / 0.1 / 0603; Style: Single; Automotive Qualified: AEC Q200; ComponentStatus: Released; PLMStatus: Active; Voltage DC (max): 75V; Legacy DeviceID: RES01801371; Part Type: Resistor; Value: 100k; Tolerance Neg: 1%; Tolerance Pos: 1%; Type: Standard; Technology: Thick Film; Temperature min: -55; Temperature max: 155; Temperature Range: Military; ROHS Compliant: Y; PackageReference: 0603; ComponentLink1Description: Vendor WebSite; ComponentLink1URL: http://www.vishay.com; ComponentLink2Description: Datasheet; ComponentLink2URL: http://webnetprod.muc.infineon.com/PCBPortal_Prod/WorkFlows/AltiumComponent/StandardDocumentation?Versionid=346743; Supplier 1: Farnell; Supplier Part Number 1: 1469649; Supplier 2: DigiKey; Supplier 3: Mouser; Second Source allowed: Yes
R124 R131 R132 = 345662: RES / STD / 1.3k / 100mW / 1% / 100ppm/K / -55°C to 155°C / 0603 / SMD / -; Multiple Parts: No; Legacy PartNumber: RES01801155; Manufacturer: Vishay; Manufacturer Order Number: CRCW06031K30FK; Symbol Type: Resistor; Single; Standard; 2 Pins; Alternate View: Yes; Article Number: 345662; Version Number: V01; Combined Parameters: TCR:100ppm/K;Tol.:-1%/+1%;Vdc:75V;Idc:-;P:100mW; QuickPick: 1.3k / 1% / 0.1 / 0603; Style: Single; Automotive Qualified: AEC Q200; ComponentStatus: Released; PLMStatus: Active; Voltage DC (max): 75V; Legacy DeviceID: RES01801155; Part Type: Resistor; Value: 1.3k; Tolerance Neg: 1%; Tolerance Pos: 1%; Type: Standard; Technology: Thick Film; Temperature min: -55; Temperature max: 155; Temperature Range: Military; ROHS Compliant: Y; PackageReference: 0603; ComponentLink1Description: Vendor WebSite; ComponentLink1URL: http://www.vishay.com; ComponentLink2Description: Datasheet; ComponentLink2URL: http://webnetprod.muc.infineon.com/PCBPortal_Prod/WorkFlows/AltiumComponent/StandardDocumentation?Versionid=345663; Supplier 1: Farnell; Supplier 2: DigiKey; Supplier 3: Mouser; Second Source allowed: Yes
R160 = 630020: RES / VAR / 10k / 500mW / 10% / 100ppm/K / -55°C to 125°C /  3 pin, 7.04 mm L X 6.71 mm W X 5.84 mm H Body / SMD / -; Multiple Parts: No; Manufacturer: Bourns; Manufacturer Order Number: 3361P-1-103GLF; Alternate View: Yes; Symbol Type: Resistor; Single; Variable; 3 Pins; Article Number: 630020; Version Number: V01; Combined Parameters: TCR:100ppm/K;Tol.:-10%/+10%;Vdc:-;Idc:-;P:500mW; QuickPick: 10k / 10% / 0.5 / SMD; Style: Single; ComponentStatus: Released; PLMStatus: Active; Part Type: Resistor; Value: 10k; Tolerance Neg: 10%; Tolerance Pos: 10%; Type: Variable; Application: Standard; Temperature min: -55; Temperature max: 125; Temperature Range: Military; ROHS Compliant: Y; Automotive Qualified: No; PackageReference: SMD; ComponentLink1Description: Vendor WebSite; ComponentLink1URL: http://www.bourns.com; ComponentLink2Description: Datasheet; ComponentLink2URL: http://webnetprod.muc.infineon.com/PCBPortal_Prod/WorkFlows/AltiumComponent/StandardDocumentation?Versionid=630021; Supplier 1: Farnell; Supplier Part Number 1: 1696060; Supplier 2: DigiKey; Supplier Part Number 2: 3361P-103GLFCT-ND; Supplier 3: Mouser; Supplier Part Number 3: 652-3361P-1-103GLF; Second Source allowed: Yes; Package Description: Potentiometer, SMD; 3 pin, 7.04 mm L X 6.71 mm W X 5.84 mm H Body
R170 = 346302: RES / STD / 17.8k / 100mW / 1% / 100ppm/K / -55°C to 155°C / 0603 / SMD / -; Multiple Parts: No; Legacy PartNumber: RES01801283; Manufacturer: Vishay; Manufacturer Order Number: CRCW060317K8FK; Symbol Type: Resistor; Single; Standard; 2 Pins; Alternate View: Yes; Article Number: 346302; Version Number: V01; Combined Parameters: TCR:100ppm/K;Tol.:-1%/+1%;Vdc:75V;Idc:-;P:100mW; QuickPick: 17.8k / 1% / 0.1 / 0603; Style: Single; Automotive Qualified: AEC Q200; ComponentStatus: Released; PLMStatus: Active; Voltage DC (max): 75V; Legacy DeviceID: RES01801283; Part Type: Resistor; Value: 17.8k; Tolerance Neg: 1%; Tolerance Pos: 1%; Type: Standard; Technology: Thick Film; Temperature min: -55; Temperature max: 155; Temperature Range: Military; ROHS Compliant: Y; PackageReference: 0603; ComponentLink1Description: Vendor WebSite; ComponentLink1URL: http://www.vishay.com; ComponentLink2Description: Datasheet; ComponentLink2URL: http://webnetprod.muc.infineon.com/PCBPortal_Prod/WorkFlows/AltiumComponent/StandardDocumentation?Versionid=346303; Supplier 1: Farnell; Supplier 2: DigiKey; Supplier 3: Mouser; Second Source allowed: Yes
R171 = 344622: RES / STD / 20R / 100mW / 1% / 100ppm/K / -55°C to 155°C / 0603 / SMD / -; Multiple Parts: No; Legacy PartNumber: RES01800947; Manufacturer: Vishay; Manufacturer Order Number: CRCW060320R0FK; Symbol Type: Resistor; Single; Standard; 2 Pins; Alternate View: Yes; Article Number: 344622; Version Number: V01; Combined Parameters: TCR:100ppm/K;Tol.:-1%/+1%;Vdc:75V;Idc:-;P:100mW; QuickPick: 20R / 1% / 0.1 / 0603; Style: Single; Automotive Qualified: AEC Q200; ComponentStatus: Released; PLMStatus: Active; Voltage DC (max): 75V; Legacy DeviceID: RES01800947; Part Type: Resistor; Value: 20R; Tolerance Neg: 1%; Tolerance Pos: 1%; Type: Standard; Technology: Thick Film; Temperature min: -55; Temperature max: 155; Temperature Range: Military; ROHS Compliant: Y; PackageReference: 0603; ComponentLink1Description: Vendor WebSite; ComponentLink1URL: http://www.vishay.com; ComponentLink2Description: Datasheet; ComponentLink2URL: http://webnetprod.muc.infineon.com/PCBPortal_Prod/WorkFlows/AltiumComponent/StandardDocumentation?Versionid=344623; Supplier 1: Farnell; Supplier 2: DigiKey; Supplier 3: Mouser; Second Source allowed: Yes
R172 = 345982: RES / STD / 4.7k / 100mW / 1% / 100ppm/K / -55°C to 155°C / 0603 / SMD / -; Multiple Parts: No; Legacy PartNumber: RES01801219; Manufacturer: Vishay; Manufacturer Order Number: CRCW06034K70FK; Symbol Type: Resistor; Single; Standard; 2 Pins; Alternate View: Yes; Article Number: 345982; Version Number: V01; Combined Parameters: TCR:100ppm/K;Tol.:-1%/+1%;Vdc:75V;Idc:-;P:100mW; QuickPick: 4.7k / 1% / 0.1 / 0603; Style: Single; Automotive Qualified: AEC Q200; ComponentStatus: Released; PLMStatus: Active; Voltage DC (max): 75V; Legacy DeviceID: RES01801219; Part Type: Resistor; Value: 4.7k; Tolerance Neg: 1%; Tolerance Pos: 1%; Type: Standard; Technology: Thick Film; Temperature min: -55; Temperature max: 155; Temperature Range: Military; ROHS Compliant: Y; PackageReference: 0603; ComponentLink1Description: Vendor WebSite; ComponentLink1URL: http://www.vishay.com; ComponentLink2Description: Datasheet; ComponentLink2URL: http://webnetprod.muc.infineon.com/PCBPortal_Prod/WorkFlows/AltiumComponent/StandardDocumentation?Versionid=345983; Supplier 1: Farnell; Supplier 2: DigiKey; Supplier 3: Mouser; Second Source allowed: Yes
S110 = 380147: Pushbutton Tactile Switch, Single Pole Single Throw, 4 Pins; Legacy PartNumber: CON01500305; Manufacturer: Schurter; Symbol type: Tactile Switch, Spring Return, Single Pole Single Throw - Normally Open, 4 Pins; Article Number: 380147; Version Number: V01; Legacy DeviceID: SCH_1301.9314; ComponentStatus: Released; PLMStatus: Active; Second Source allowed: Yes; Voltage DC (max): na; Part Type: Electro Mechanic; Manufacturer Order Number: 1301.9314; Value: 1301.9314; Temperature min: -20; Temperature max: 70; Temperature Range: Commercial; ROHS Compliant: Y; ComponentLink1Description: Vendor WebSite; ComponentLink1URL: http://www.schurter.com.sg/; ComponentLink2Description: Datasheet; ComponentLink2URL: http://webnetprod.muc.infineon.com/PCBPortal_Prod/WorkFlows/AltiumComponent/StandardDocumentation?Versionid=380148; Supplier 1: Farnell; Supplier Part Number 1: 1217763; Supplier 2: DigiKey; Supplier Part Number 2: 1301.9314-ND; Supplier 3: Mouser; Supplier Part Number 3: 693-1301.9314; Package Description: SMD Switch, 6.00mm L X 6.00mm W X 4.3mm H body
TP103 = 382410: PC Test Point-Multipurpose THT, Black; Multiple Parts: No; Legacy PartNumber: CON01500530; Manufacturer: Keystone Electronics Corp.; Symbol Type: Connector, 1 Lead, Female; Alternate View: Yes; Article Number: 382410; Version Number: V01; Legacy DeviceID: KEY_5011; Combined Parameters: Board-to-Cable None (onboard);1x1;Mounting:THT;Orient:0° (vertical);Shielded:No; QuickPick: 0° (vertical) / Board-to-Cable; Style: Not Applicable; ComponentStatus: Released; PLMStatus: Active; Voltage DC (max): na; Part Type: Connector; Manufacturer Order Number: 5011; Value: 5011; Type: Board-to-Cable; Application: Test; Temperature min: 0; Temperature max: 0; Temperature Range: Military; ROHS Compliant: Y; Automotive Qualified: No; ComponentLink1Description: Vendor WebSite; ComponentLink1URL: http://www.keyelco.com/; ComponentLink2Description: Datasheet; ComponentLink2URL: http://webnetprod.muc.infineon.com/PCBPortal_Prod/WorkFlows/AltiumComponent/StandardDocumentation?Versionid=382411; Supplier 1: Farnell; Supplier Part Number 1: 2431148; Supplier 2: DigiKey; Supplier Part Number 2: 36-5011-ND; Supplier 3: Mouser; Supplier Part Number 3: 534-5011; Second Source allowed: Yes; Package Description: Test Point, 1.78 mm Lead Width, Round, 3.17 mm Dia X 8.28 mm H body
U520 = 409035: Quad Differential Comparator; Legacy PartNumber: IC02600564; Manufacturer: Texas Instruments; Alternate View: Yes; Article Number: 409035; Version Number: V01; Legacy DeviceID: TI_LM339; Combined Parameters: Res.:-;Fmax:-; QuickPick: TSSOP-14 (PW); Automotive Qualified: No; ComponentStatus: Released; PLMStatus: Active; Voltage DC (max): na; Symbol Type: Quad Differential Comparator; Part Type: Analog Parts; Manufacturer Order Number: LM339PWR; Value: LM339PWR; Temperature min: 0; Temperature max: 0; Temperature Range: Military; PackageReference: TSSOP-14 (PW); ComponentLink1Description: Vendor WebSite; ComponentLink1URL: http://www.ti.com; ComponentLink2Description: Datasheet; ComponentLink2URL: http://webnetprod.muc.infineon.com/PCBPortal_Prod/WorkFlows/AltiumComponent/StandardDocumentation?Versionid=409036; Supplier 1: Farnell; Supplier Part Number 1: 2436009; Supplier 2: DigiKey; Supplier Part Number 2: 296-6607-2-ND; Supplier 3: Mouser; Supplier Part Number 3: 595-LM339PWR; Second Source allowed: Yes
W100 = 453053: SMD Net Tie for two Nets; Legacy PartNumber: CON01501379; Manufacturer: Infineon Technologies; Manufacturer Order Number: Net Tie_small_2p; Alternate View: Yes; Article Number: 453053; Version Number: V01; Legacy DeviceID: CON_Net Tie_small_2p; Value: Net Tie_small_2p; Combined Parameters: - onboard connector;-x-;Mounting:SMT;Orient:-;Shielded:-; ComponentStatus: Released; PLMStatus: Active; Voltage DC (max): na; Symbol Type: Net Tie for two Nets; Part Type: Connector; Temperature min: 0; Temperature max: 0; Temperature Range: Military; PackageReference: SMD; ComponentLink1Description: Vendor WebSite; ComponentLink1URL: https://www.infineon.com/; ComponentLink2Description: Datasheet; Supplier 1: Farnell; Supplier 2: DigiKey; Supplier 3: Mouser; Second Source allowed: Yes; Package Description: SMD Net Tie 0.2mm x 0.6mm
X100-X103 = 599069: Non Insulated Jack, Brass; Multiple Parts: No; Manufacturer: Keystone Electronics Corp.; Symbol Type: Connector, 1 Lead, Female; Alternate View: Yes; Article Number: 599069; Version Number: V01; Legacy DeviceID: KEY_575-8; Combined Parameters: Board-to-Cable Socket (female);-x-;Mounting:THT;Orient:0° (vertical);Shielded:No; QuickPick: 0° (vertical) / Board-to-Cable; Style: Banana; ComponentStatus: Released; PLMStatus: Active; Voltage DC (max): na; Part Type: Connector; Manufacturer Order Number: 575-8; Value: 575-8; Type: Board-to-Cable; Temperature min: 0; Temperature max: 0; Temperature Range: Military; ROHS Compliant: N; Automotive Qualified: No; PackageReference: THT; ComponentLink1Description: Vendor WebSite; ComponentLink1URL: http://www.keyelco.com/; ComponentLink2Description: Datasheet; ComponentLink2URL: http://webnetprod.muc.infineon.com/PCBPortal_Prod/WorkFlows/AltiumComponent/StandardDocumentation?Versionid=599070; Supplier 1: Farnell; Supplier 2: DigiKey; Supplier Part Number 2: 36-575-8-ND; Supplier 3: Mouser; Supplier Part Number 3: 534-575-8; Second Source allowed: Yes; Package Description: Terminal; 1 pin, 7.92 mm D X 2.51 mm H body
X110 = 644888: Arduino Uno is a microcontroller board based on the ATmega328P; Manufacturer: Infineon Technologies; Alternate View: Yes; Article Number: 644888; Version Number: V01; Legacy DeviceID: Infineon_Arduino-Uno; Combined Parameters: Board-to-Board Socket (female);-x-;Mounting:THT;Orient:0° (vertical);Shielded:-; QuickPick: 0° (vertical) / Board-to-Board; Automotive Qualified: No; ComponentStatus: Released; PLMStatus: Active; Voltage DC (max): na; Symbol Type: Arduino Uno is a microcontroller board based on the ATmega328P; Multiple Parts: Yes; Part Type: Connector; Manufacturer Order Number: Arduino-Uno; Value: Arduino-Uno; Type: Board-to-Board; Temperature min: -40; Temperature max: 85; Temperature Range: Industrial; ROHS Compliant: N; PackageReference: THT; ComponentLink1Description: Vendor WebSite; ComponentLink1URL: https://www.infineon.com/; ComponentLink2Description: Datasheet; Supplier 1: Farnell; Supplier 2: DigiKey; Supplier 3: Mouser; Second Source allowed: Yes; Package Description: Arduino-Uno, THT, 32 Pin, 68.58 mm L X 53.34 mm W X 8.64 mm H body
X140 = 381343: Through hole .025 SQ Post Header, 2.54mm pitch, 12 pin, vertical, single row; Legacy PartNumber: CON01500432; Manufacturer: Samtec; Article Number: 381343; Version Number: V01; Legacy DeviceID: SAM_TSW-112-07-L-S; Combined Parameters: Board-to-Board Header (male);12x1;Mounting:THT;Orient:0° (vertical);Shielded:No; QuickPick: 0° (vertical) / Board-to-Board; Style: Strip; Automotive Qualified: No; ComponentStatus: Released; PLMStatus: Active; Second Source allowed: Yes; Voltage DC (max): na; Part Type: Connector; Manufacturer Order Number: TSW-112-07-L-S; Value: TSW-112-07-L-S; Type: Board-to-Board; Temperature min: -55; Temperature max: 125; Temperature Range: Military; ROHS Compliant: Y; ComponentLink1Description: Vendor WebSite; ComponentLink1URL: http://www.samtec.com/; ComponentLink2Description: Datasheet; ComponentLink2URL: http://webnetprod.muc.infineon.com/PCBPortal_Prod/WorkFlows/AltiumComponent/StandardDocumentation?Versionid=381344; Supplier 1: Farnell; Supplier Part Number 1: 2035615; Supplier 2: DigiKey; Supplier Part Number 2: SAM1031-12-ND; Supplier 3: Mouser; Package Description: Header,vertical,2.54mm pitch;0.64mm lead width,12 pins,1 row,12 pins per row,30.48mm L X 2.54mm W X 8.98mm H body
X150 = 638630: WR-BHD Male Box Header, 2.54mm pitch, 10 pin, Vertical, Double row; Manufacturer: Wurth Elektronik; Article Number: 638630; Version Number: V01; Legacy DeviceID: WE_61201021621; Combined Parameters: Board-to-Board/Cable Header (male);5x2;Mounting:THT;Orient:0° (vertical);Shielded:No; QuickPick: 0° (vertical) / Board-to-Board/Cable; Style: Strip; Automotive Qualified: No; ComponentStatus: Released; PLMStatus: Active; Second Source allowed: Yes; Voltage DC (max): na; Part Type: Connector; Manufacturer Order Number: 61201021621; Value: 61201021621; Type: Board-to-Board/Cable; Temperature min: -40; Temperature max: 105; Temperature Range: Industrial; ROHS Compliant: Y; PackageReference: THT; ComponentLink1Description: Vendor WebSite; ComponentLink1URL: http://www.we-online.com; ComponentLink2Description: Datasheet; ComponentLink2URL: http://webnetprod.muc.infineon.com/PCBPortal_Prod/WorkFlows/AltiumComponent/StandardDocumentation?Versionid=638631; Supplier 1: Farnell; Supplier Part Number 1: 1642019; Supplier 2: DigiKey; Supplier Part Number 2: 732-2094-ND; Supplier 3: Mouser; Supplier Part Number 3: 710-61201021621; Package Description: Connector, THT, 2.54mm Pitch; 10 Pins, 9.10 mm L X 20.36 mm W X 9.25 mm H body